# EAGLE schematic zx81_kbd (EAGLE 9.6.2)
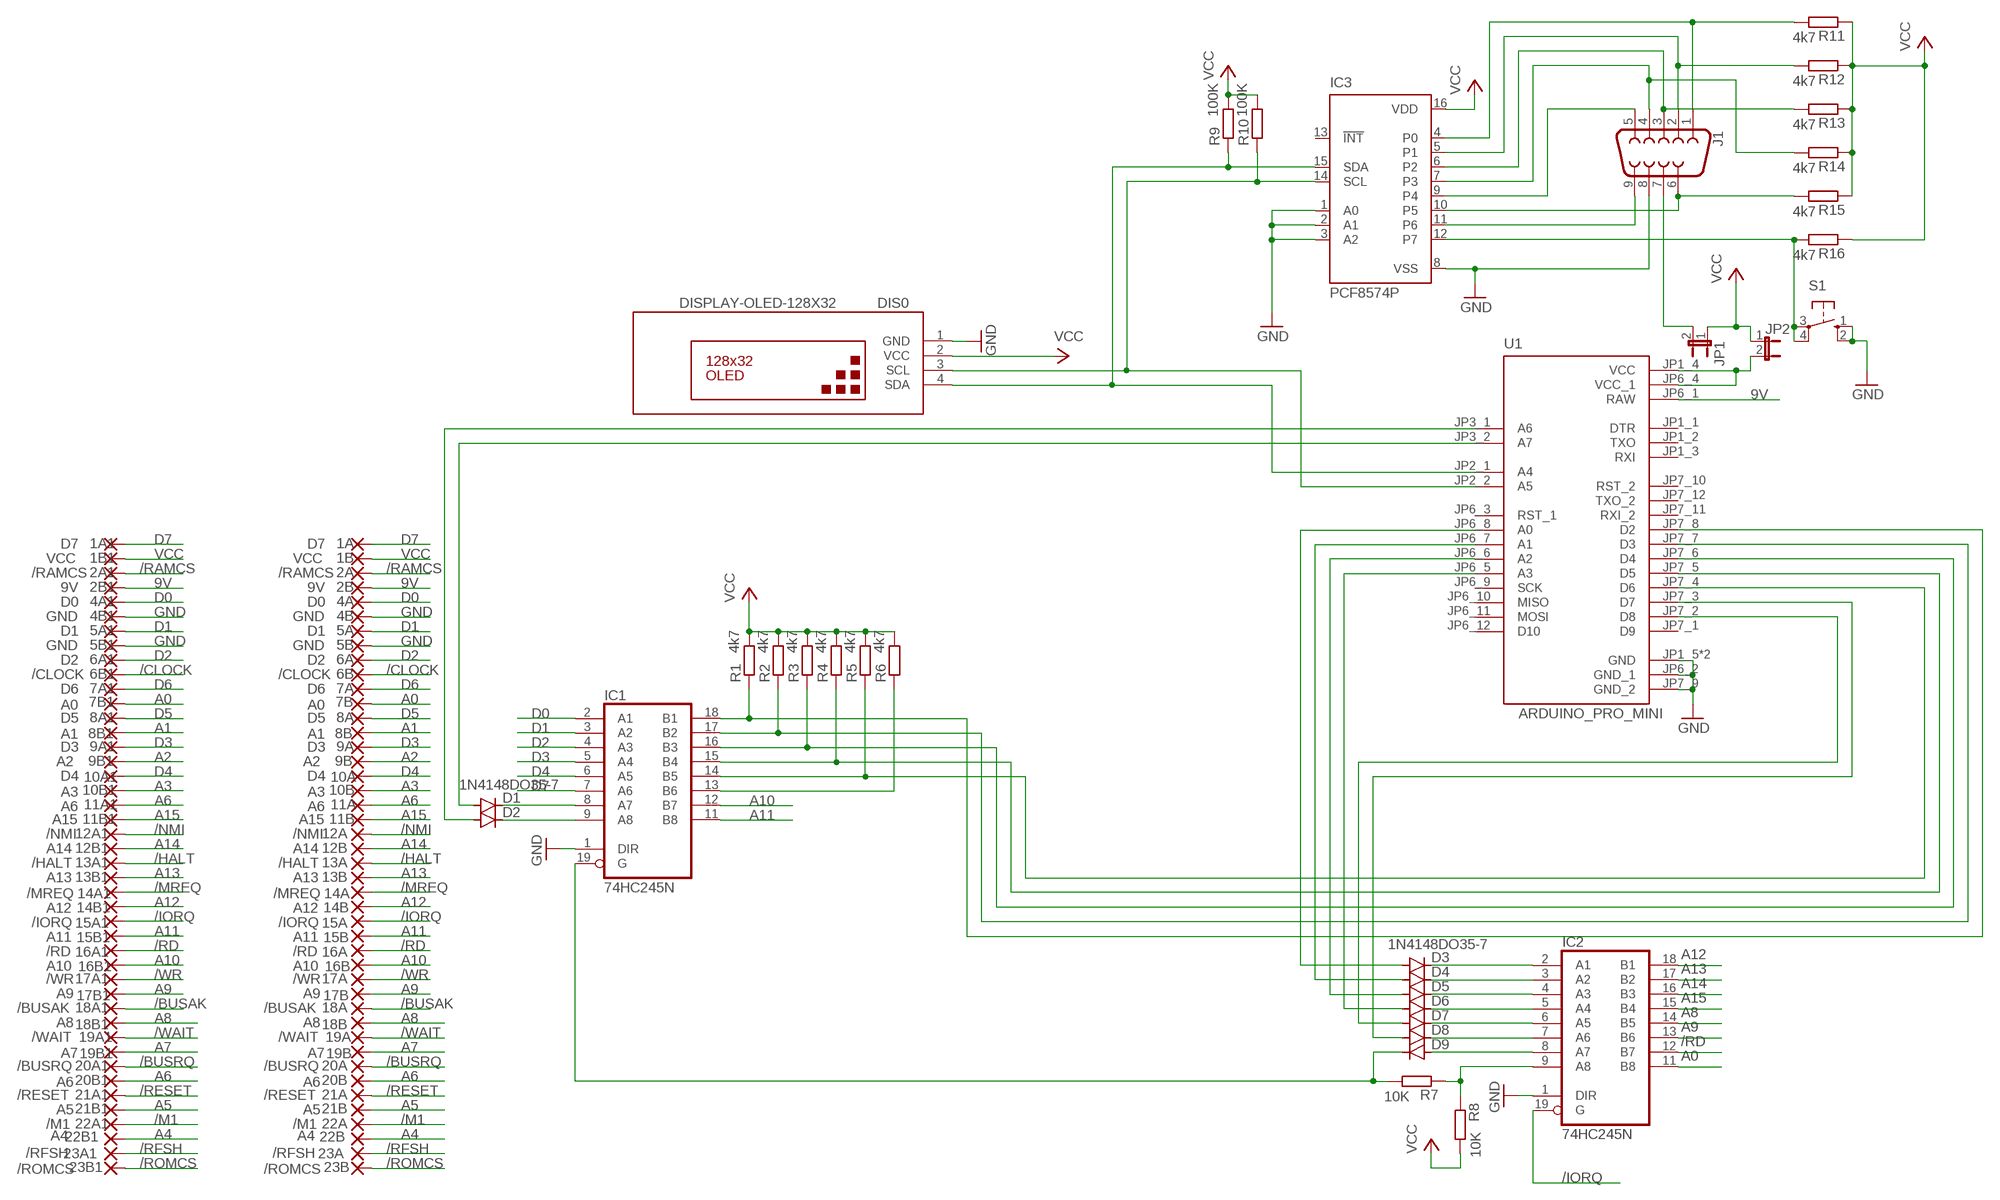
[diagram p0: schematic, sheet 1]

## Parts
1A  D7  SMD2EDGEPIN  [EDGEPIN]
1A1  D7  SMD2EDGEPIN  [EDGEPIN]
1B  VCC  SMD2EDGEPIN  [EDGEPIN]
1B1  VCC  SMD2EDGEPIN  [EDGEPIN]
2A  /RAMCS  SMD2EDGEPIN  [EDGEPIN]
2A1  /RAMCS  SMD2EDGEPIN  [EDGEPIN]
2B  9V  SMD2EDGEPIN  [EDGEPIN]
2B1  9V  SMD2EDGEPIN  [EDGEPIN]
4A  D0  SMD2EDGEPIN  [EDGEPIN]
4A1  D0  SMD2EDGEPIN  [EDGEPIN]
4B  GND  SMD2EDGEPIN  [EDGEPIN]
4B1  GND  SMD2EDGEPIN  [EDGEPIN]
5A  D1  SMD2EDGEPIN  [EDGEPIN]
5A1  D1  SMD2EDGEPIN  [EDGEPIN]
5B  GND  SMD2EDGEPIN  [EDGEPIN]
5B1  GND  SMD2EDGEPIN  [EDGEPIN]
6A  D2  SMD2EDGEPIN  [EDGEPIN]
6A1  D2  SMD2EDGEPIN  [EDGEPIN]
6B  /CLOCK  SMD2EDGEPIN  [EDGEPIN]
6B1  /CLOCK  SMD2EDGEPIN  [EDGEPIN]
7A  D6  SMD2EDGEPIN  [EDGEPIN]
7A1  D6  SMD2EDGEPIN  [EDGEPIN]
7B  A0  SMD2EDGEPIN  [EDGEPIN]
7B1  A0  SMD2EDGEPIN  [EDGEPIN]
8A  D5  SMD2EDGEPIN  [EDGEPIN]
8A1  D5  SMD2EDGEPIN  [EDGEPIN]
8B  A1  SMD2EDGEPIN  [EDGEPIN]
8B1  A1  SMD2EDGEPIN  [EDGEPIN]
9A  D3  SMD2EDGEPIN  [EDGEPIN]
9A1  D3  SMD2EDGEPIN  [EDGEPIN]
9B  A2  SMD2EDGEPIN  [EDGEPIN]
9B1  A2  SMD2EDGEPIN  [EDGEPIN]
10A  D4  SMD2EDGEPIN  [EDGEPIN]
10A1  D4  SMD2EDGEPIN  [EDGEPIN]
10B  A3  SMD2EDGEPIN  [EDGEPIN]
10B1  A3  SMD2EDGEPIN  [EDGEPIN]
11A  A6  SMD2EDGEPIN  [EDGEPIN]
11A1  A6  SMD2EDGEPIN  [EDGEPIN]
11B  A15  SMD2EDGEPIN  [EDGEPIN]
11B1  A15  SMD2EDGEPIN  [EDGEPIN]
12A  /NMI  SMD2EDGEPIN  [EDGEPIN]
12A1  /NMI  SMD2EDGEPIN  [EDGEPIN]
12B  A14  SMD2EDGEPIN  [EDGEPIN]
12B1  A14  SMD2EDGEPIN  [EDGEPIN]
13A  /HALT  SMD2EDGEPIN  [EDGEPIN]
13A1  /HALT  SMD2EDGEPIN  [EDGEPIN]
13B  A13  SMD2EDGEPIN  [EDGEPIN]
13B1  A13  SMD2EDGEPIN  [EDGEPIN]
14A  /MREQ  SMD2EDGEPIN  [EDGEPIN]
14A1  /MREQ  SMD2EDGEPIN  [EDGEPIN]
14B  A12  SMD2EDGEPIN  [EDGEPIN]
14B1  A12  SMD2EDGEPIN  [EDGEPIN]
15A  /IORQ  SMD2EDGEPIN  [EDGEPIN]
15A1  /IORQ  SMD2EDGEPIN  [EDGEPIN]
15B  A11  SMD2EDGEPIN  [EDGEPIN]
15B1  A11  SMD2EDGEPIN  [EDGEPIN]
16A  /RD  SMD2EDGEPIN  [EDGEPIN]
16A1  /RD  SMD2EDGEPIN  [EDGEPIN]
16B  A10  SMD2EDGEPIN  [EDGEPIN]
16B1  A10  SMD2EDGEPIN  [EDGEPIN]
17A  /WR  SMD2EDGEPIN  [EDGEPIN]
17A1  /WR  SMD2EDGEPIN  [EDGEPIN]
17B  A9  SMD2EDGEPIN  [EDGEPIN]
17B1  A9  SMD2EDGEPIN  [EDGEPIN]
18A  /BUSAK  SMD2EDGEPIN  [EDGEPIN]
18A1  /BUSAK  SMD2EDGEPIN  [EDGEPIN]
18B  A8  SMD2EDGEPIN  [EDGEPIN]
18B1  A8  SMD2EDGEPIN  [EDGEPIN]
19A  /WAIT  SMD2EDGEPIN  [EDGEPIN]
19A1  /WAIT  SMD2EDGEPIN  [EDGEPIN]
19B  A7  SMD2EDGEPIN  [EDGEPIN]
19B1  A7  SMD2EDGEPIN  [EDGEPIN]
20A  /BUSRQ  SMD2EDGEPIN  [EDGEPIN]
20A1  /BUSRQ  SMD2EDGEPIN  [EDGEPIN]
20B  A6  SMD2EDGEPIN  [EDGEPIN]
20B1  A6  SMD2EDGEPIN  [EDGEPIN]
21A  /RESET  SMD2EDGEPIN  [EDGEPIN]
21A1  /RESET  SMD2EDGEPIN  [EDGEPIN]
21B  A5  SMD2EDGEPIN  [EDGEPIN]
21B1  A5  SMD2EDGEPIN  [EDGEPIN]
22A  /M1  SMD2EDGEPIN  [EDGEPIN]
22A1  /M1  SMD2EDGEPIN  [EDGEPIN]
22B  A4  SMD2EDGEPIN  [EDGEPIN]
22B1  A4  SMD2EDGEPIN  [EDGEPIN]
23A  /RFSH  SMD2EDGEPIN  [EDGEPIN]
23A1  /RFSH  SMD2EDGEPIN  [EDGEPIN]
23B  /ROMCS  SMD2EDGEPIN  [EDGEPIN]
23B1  /ROMCS  SMD2EDGEPIN  [EDGEPIN]
D1  1N4148DO35-7  [DO35-7]
D2  1N4148DO35-7  [DO35-7]
D3  1N4148DO35-7  [DO35-7]
D4  1N4148DO35-7  [DO35-7]
D5  1N4148DO35-7  [DO35-7]
D6  1N4148DO35-7  [DO35-7]
D7  1N4148DO35-7  [DO35-7]
D8  1N4148DO35-7  [DO35-7]
D9  1N4148DO35-7  [DO35-7]
DIS0  DISPLAY-OLED-128X32  [DISPLAY-OLED-128X32]
IC1  74HC245N  [DIL20]
IC2  74HC245N  [DIL20]
IC3  PCF8574P  [DIL16]
J1  DB9MALE  [DB9_MALE]
JP1  JP1E  [JP1]
JP2  JP1E  [JP1]
R1  4k7  R-EU_0204/7  [0204/7]
R2  4k7  R-EU_0204/7  [0204/7]
R3  4k7  R-EU_0204/7  [0204/7]
R4  4k7  R-EU_0204/7  [0204/7]
R5  4k7  R-EU_0204/7  [0204/7]
R6  4k7  R-EU_0204/7  [0204/7]
R7  10K  R-EU_0204/7  [0204/7]
R8  10K  R-EU_0204/7  [0204/7]
R9  100K  R-EU_0204/7  [0204/7]
R10  100K  R-EU_0204/7  [0204/7]
R11  4k7  R-EU_0204/7  [0204/7]
R12  4k7  R-EU_0204/7  [0204/7]
R13  4k7  R-EU_0204/7  [0204/7]
R14  4k7  R-EU_0204/7  [0204/7]
R15  4k7  R-EU_0204/7  [0204/7]
R16  4k7  R-EU_0204/7  [0204/7]
S1  10-XX11MM  [B3F-10XX_11MM]
U1  ARDUINO_PRO_MINI  [MODULE_ARDUINO_PRO_MINI]

## Nets
9V [VCC]: 2B1.1(P) 2B.1(P) U1.JP6_1(RAW)
/BUSAK: 18A1.1(P) 18A.1(P)
/BUSRQ: 20A1.1(P) 20A.1(P)
/CLOCK: 6B1.1(P) 6B.1(P)
/HALT: 13A1.1(P) 13A.1(P)
/IORQ: 15A1.1(P) 15A.1(P) IC2.19(G)
/M1: 22A1.1(P) 22A.1(P)
/MREQ: 14A1.1(P) 14A.1(P)
/NMI: 12A1.1(P) 12A.1(P)
/RAMCS: 2A1.1(P) 2A.1(P)
/RD: 16A1.1(P) 16A.1(P) IC2.12(B7)
/RESET: 21A1.1(P) 21A.1(P)
/RFSH: 23A1.1(P) 23A.1(P)
/ROMCS: 23B1.1(P) 23B.1(P)
/WAIT: 19A1.1(P) 19A.1(P)
/WR: 17A1.1(P) 17A.1(P)
A0: 7B1.1(P) 7B.1(P) IC2.11(B8)
A1: 8B1.1(P) 8B.1(P)
A2: 9B1.1(P) 9B.1(P)
A3: 10B1.1(P) 10B.1(P)
A4: 22B1.1(P) 22B.1(P)
A5: 21B1.1(P) 21B.1(P)
A6: 11A1.1(P) 11A.1(P) 20B1.1(P) 20B.1(P)
A7: 19B1.1(P) 19B.1(P)
A8: 18B1.1(P) 18B.1(P) IC2.14(B5)
A9: 17B1.1(P) 17B.1(P) IC2.13(B6)
A10: 16B1.1(P) 16B.1(P) IC1.12(B7)
A11: 15B1.1(P) 15B.1(P) IC1.11(B8)
A12: 14B1.1(P) 14B.1(P) IC2.18(B1)
A13: 13B1.1(P) 13B.1(P) IC2.17(B2)
A14: 12B1.1(P) 12B.1(P) IC2.16(B3)
A15: 11B1.1(P) 11B.1(P) IC2.15(B4)
D0: 4A1.1(P) 4A.1(P) IC1.2(A1)
D1: 5A1.1(P) 5A.1(P) IC1.3(A2)
D2: 6A1.1(P) 6A.1(P) IC1.4(A3)
D3: 9A1.1(P) 9A.1(P) IC1.5(A4)
D4: 10A1.1(P) 10A.1(P) IC1.6(A5)
D5: 8A1.1(P) 8A.1(P)
D6: 7A1.1(P) 7A.1(P)
D7: 1A1.1(P) 1A.1(P) IC1.7(A6)
GND [VCC]: 4B1.1(P) 4B.1(P) 5B1.1(P) 5B.1(P) DIS0.1(GND) IC1.1(DIR) IC2.1(DIR) IC3.1(A0) IC3.2(A1) IC3.3(A2) IC3.8(VSS) J1.8 S1.1(S) S1.2(S1) U1.JP1_5(GND) U1.JP1_6(GND) U1.JP6_2(GND_1) U1.JP7_9(GND_2)
N$1: D3.C IC2.2(A1)
N$2: IC1.18(B1) R1.1 U1.JP7_8(D2)
N$3: IC1.17(B2) R2.1 U1.JP7_7(D3)
N$4: IC1.16(B3) R3.1 U1.JP7_6(D4)
N$5 [VCC]: JP2.2 U1.JP1_4(VCC) U1.JP6_4(VCC_1)
N$6: IC1.14(B5) R5.1 U1.JP7_4(D6)
N$7: IC1.13(B6) R6.1
N$8: D4.C IC2.3(A2)
N$9: D5.C IC2.4(A3)
N$10: D6.C IC2.5(A4)
N$11: D7.C IC2.6(A5)
N$12: D8.C IC2.7(A6)
N$13: D9.A IC2.8(A7)
N$14: IC2.9(A8) R7.1 R8.1
N$15: D1.A U1.JP3_2(A7)
N$16: D1.C IC1.8(A7)
N$17: D2.C IC1.9(A8)
N$18: D9.C IC1.19(G) R7.2
N$19: D2.A U1.JP3_1(A6)
N$20: DIS0.4(SDA) IC3.15(SDA) R9.1 U1.JP2_1(A4)
N$21: DIS0.3(SCL) IC3.14(SCL) R10.1 U1.JP2_2(A5)
N$22: D6.A U1.JP6_5(A3)
N$23: D5.A U1.JP6_6(A2)
N$24: D4.A U1.JP6_7(A1)
N$26: D7.A U1.JP7_2(D8)
N$28: D8.A U1.JP7_3(D7)
N$29: IC3.4(P0) J1.1 R11.2
N$30: IC1.15(B4) R4.1 U1.JP7_5(D5)
N$31: D3.A U1.JP6_8(A0)
N$32: IC3.5(P1) J1.2 R12.2
N$33: IC3.6(P2) J1.3 R13.2
N$34: IC3.7(P3) J1.4 R14.2
N$35: IC3.10(P5) J1.6 R15.2
N$36: IC3.9(P4) J1.5
N$37: IC3.12(P7) R16.2 S1.3(P) S1.4(P1)
N$38: J1.7 JP1.2
N$39: IC3.11(P6) J1.9
VCC [VCC]: 1B1.1(P) 1B.1(P) DIS0.2(VCC) IC3.16(VDD) JP1.1 JP2.1 R1.2 R2.2 R3.2 R4.2 R5.2 R6.2 R8.2 R9.2 R10.2 R11.1 R12.1 R13.1 R14.1 R15.1 R16.1
Unconnected: IC3.13(!INT) U1.JP1_1(DTR) U1.JP1_2(TXO) U1.JP1_3(RXI) U1.JP6_3(RST_1) U1.JP6_9(SCK) U1.JP6_10(MISO) U1.JP6_11(MOSI) U1.JP6_12(D10) U1.JP7_1(D9) U1.JP7_10(RST_2) U1.JP7_11(RXI_2) U1.JP7_12(TXO_2)

## Power pins joined to a net without a drawn wire
GND: IC1.10(GND) IC2.10(GND)
VCC: IC1.20(VCC) IC2.20(VCC)

## Library data of the parts
1A 1A1 1B 1B1 2A 2A1 2B 2B1 4A 4A1 4B 4B1 5A 5A1 5B 5B1 6A 6A1 6B 6B1 7A 7A1 7B 7B1 8A 8A1 8B 8B1 9A 9A1 9B 9B1 10A 10A1 10B 10B1 11A 11A1 11B 11B1 12A 12A1 12B 12B1 13A 13A1 13B 13B1 14A 14A1 14B 14B1 15A 15A1 15B 15B1 16A 16A1 16B 16B1 17A 17A1 17B 17B1 18A 18A1 18B 18B1 19A 19A1 19B 19B1 20A 20A1 20B 20B1 21A 21A1 21B 21B1 22A 22A1 22B 22B1 23A 23A1 23B 23B1 = wirepad:SMD2: SMD PAD
D1-D9 = diode:1N4148: DIODE high speed (Philips)
DIS0 = diy-modules:DISPLAY-OLED-128X32: 128x32 Dot Matrix OLED Module with I2C interface based on SSD1306 chip More details available here: http://www.tinyosshop.com/index.php?route=product/product&product_id=953 Schematic available here: http://www.tinyosshop.com/datasheet/OLED%2012832.pdf SSD1306 datasheet: https://cdn-shop.adafruit.com/datasheets/SSD1306.pdf Click here to find device on ebay.com <http://www.ebay.com/sch/oled+display+128x32+i2c>
IC1 IC2 = 74xx-eu:74*245: Octal BUS TRANSCEIVER, 3-state
IC3 = micro-philips:PCF8574: I2C-Bus Remote 8-bit I/O expander http://www.semiconductors.philips.com/acrobat_download/datasheets/PCF8574_4.pdf; MPN: PCF8574PN; OC_FARNELL: 204020; OC_NEWARK: 11N8515
J1 = SparkFun-Connectors:DB9: DB9 Connector Standard DB9 (D-Sub 9) serial connector. Can be used for CAN bus as well as RS485 and RS232. Footprint production proven. Here is the female version connector we sell at SparkFun: 9 Pin Female Serial Connector - PCB Mount <https://www.sparkfun.com/products/429> (PRT-00429) This connector has been used on the following SparkFun products: SparkFun RS232 Shifter - SMD <https://www.sparkfun.com/products/449> (PRT-00449) SparkFun RS232 Shifter SMD (No DB9) <https://www.sparkfun.com/products/8780> (PRT-08780); PROD_ID: CONN-09904
JP1 JP2 = jumper:JP1E: JUMPER
R1-R16 = rcl:R-EU_: RESISTOR, European symbol; SPICEPREFIX: R
S1 = switch-omron:10-XX: OMRON SWITCH
U1 = ARDUINO_PRO_MINI:ARDUINO_PRO_MINI: ATmega328 Arduino Pro Mini 328 5V/16MHz AVR® ATmega AVR MCU 8-Bit Embedded Evaluation Board Check availability <https://pricing.snapeda.com/parts/Arduino%20Pro%20Mini/Arduino/view-part?ref=eda>; AVAILABILITY: In Stock; CHECK_PRICES: https://www.snapeda.com/parts/Arduino%20Pro%20Mini/Arduino/view-part/?ref=eda; DESCRIPTION: This board was developed for applications and installations where space is premium and projects are made as permanent set ups. Small, available in 3.3 V and 5 V versions, powered by ATmega328P.; MF: Arduino; MP: Arduino Pro Mini; PACKAGE: None; PRICE: None; SNAPEDA_LINK: https://www.snapeda.com/parts/Arduino%20Pro%20Mini/Arduino/view-part/?ref=snap

## Net classes
0 default: width 0.127 mm, drill 0.2 mm, clearance 0.127 mm
1 VCC: width 0.3 mm